# EAGLE design DCDeluxe (EAGLE 6.5.0)

## Sheet 1 of 3
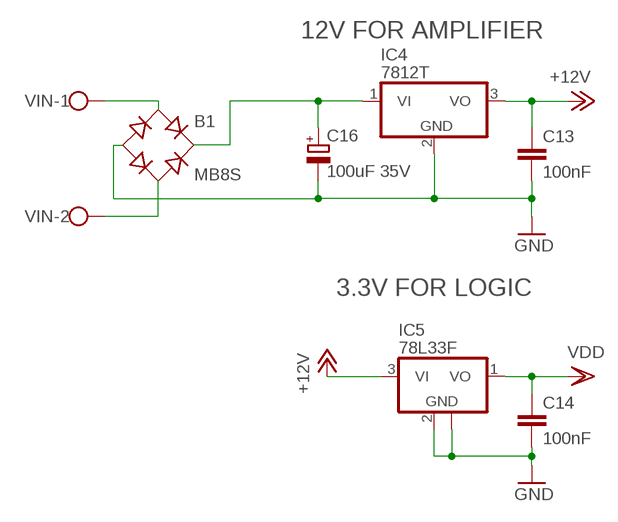
[diagram p0: schematic, sheet 1]

### Parts
B1  MB8S  [SOIC-4]
C13  100nF  C-EUC0603  [C0603]
C14  100nF  C-EUC0603  [C0603]
C16  100uF 35V  CPOL-EU153CLV-0807  [153CLV-0807]
IC4  7812T  [TO220H]
IC5  78L33F  78L05F  [SOT89]
VIN  W237-102  [W237-102]

### Nets
+12V [analog_pwr]: C13.1 IC4.3(VO) IC5.3(VI) ; also sheet 2,3
GND [analog_pwr]: B1.- C13.2 C14.2 C16.- IC4.2(GND) IC5.2(GND) IC5.2@1(GND) ; also sheet 2,3
VDD: C14.1 IC5.1(VO) ; also sheet 2
VIN1 [system_pwr]: B1.~1(AC1) VIN.1 ; also sheet 2
VIN2: B1.~2(AC2) VIN.2 ; also sheet 2
VIN+: B1.+ C16.+ IC4.1(VI)

### Notes on the sheet
- 12V FOR AMPLIFIER
- 3.3V FOR LOGIC

## Sheet 2 of 3: Logic
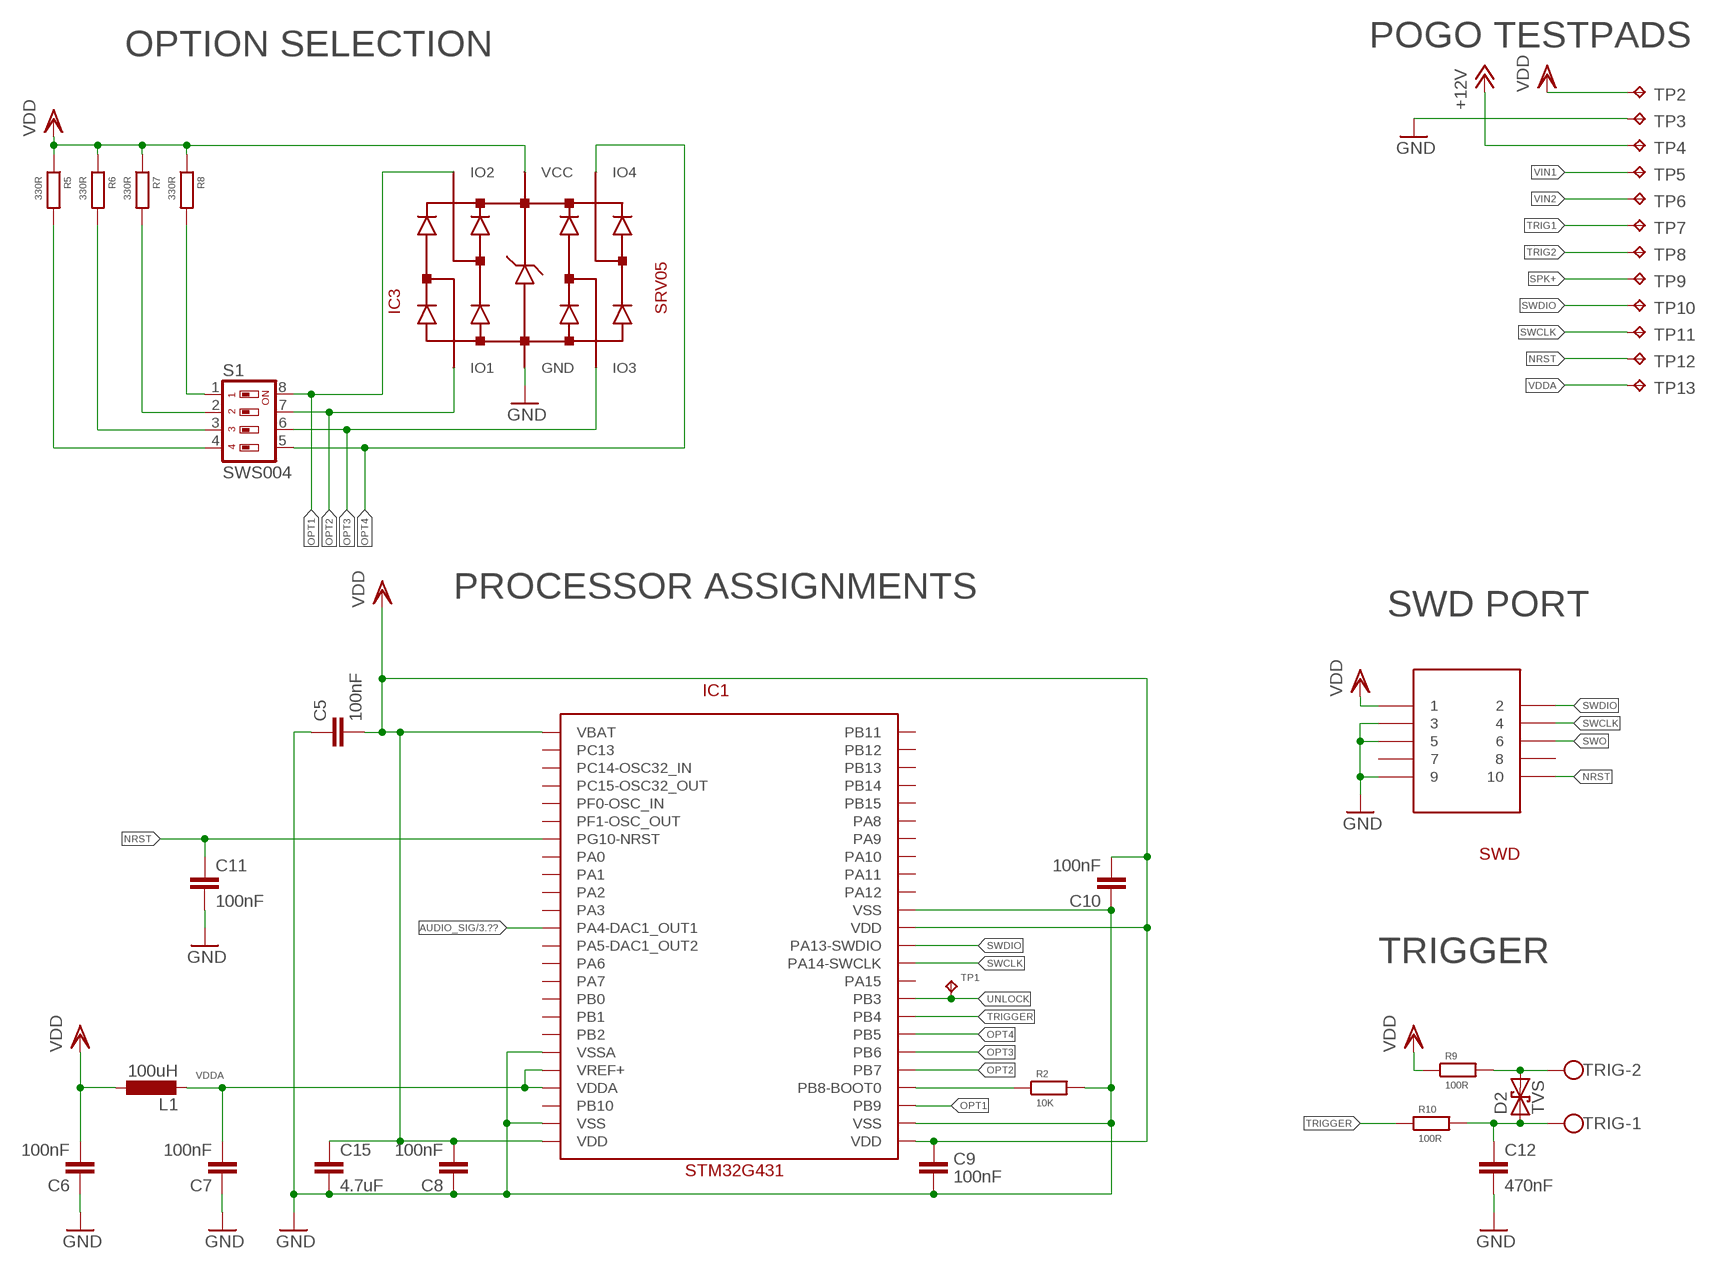
[diagram p1: schematic, sheet 2]

### Parts
C5  100nF  C-EUC0603  [C0603]
C6  100nF  C-EUC0603  [C0603]
C7  100nF  C-EUC0603  [C0603]
C8  100nF  C-EUC0603  [C0603]
C9  100nF  C-EUC0603  [C0603]
C10  100nF  C-EUC0603  [C0603]
C11  100nF  C-EUC0603  [C0603]
C12  470nF  C-EUC0603  [C0603]
C15  4.7uF  C-EUC0603  [C0603]
D2  TVS  [SMA-DIODE]
IC1  STM32G431  STM32G431-C8T6  [TQFP48]
IC3  SRV05  SRV05-TSOP6  [TSOP-6]
L1  100uH  L-EUL3225M  [L3225M]
R2  10K  R-EU_R0603  [R0603]
R5  330R  R-EU_R0603  [R0603]
R6  330R  R-EU_R0603  [R0603]
R7  330R  R-EU_R0603  [R0603]
R8  330R  R-EU_R0603  [R0603]
R9  100R  R-EU_R0603  [R0603]
R10  100R  R-EU_R0603  [R0603]
S1  SWS004  [SMS-004]
SWD  FTSH-105-01  [FTSH-105-01-XXX-DV-K]
TP1  TPTP12R  [TP12R]
TP2  TPTP20R  [TP20R]
TP3  TPTP20R  [TP20R]
TP4  TPTP20R  [TP20R]
TP5  TPTP20R  [TP20R]
TP6  TPTP20R  [TP20R]
TP7  TPTP20R  [TP20R]
TP8  TPTP20R  [TP20R]
TP9  TPTP20R  [TP20R]
TP10  TPTP20R  [TP20R]
TP11  TPTP20R  [TP20R]
TP12  TPTP20R  [TP20R]
TP13  TPTP20R  [TP20R]
TRIG  W237-102  [W237-102]

### Nets
+12V [analog_pwr]: TP4.TP ; also sheet 1,3
AUDIO_SIG [analog_sig]: IC1.PA4-DAC1_OUT1 ; also sheet 3
BOOT0: IC1.PB8-BOOT0 R2.1
GND [analog_pwr]: C5.1 C6.1 C7.1 C8.1 C9.1 C10.1 C11.2 C12.2 C15.2 IC1.VSS@23(VSS) IC1.VSS@35(VSS) IC1.VSS@47(VSS) IC1.VSSA IC3.GND R2.2 SWD.3 SWD.5 SWD.9 TP3.TP ; also sheet 1,3
N$9: R8.2 S1.1
N$10: R7.2 S1.2
N$11: R6.2 S1.3
N$12: R5.2 S1.4
NRST: C11.1 IC1.PG10-NRST SWD.10 TP12.TP
OPT1: IC1.PB9 IC3.IO2 S1.8
OPT2: IC1.PB7 IC3.IO1 S1.7
OPT3: IC1.PB6 IC3.IO3 S1.6
OPT4: IC1.PB5 IC3.IO4 S1.5
SPK+ [analog_pwr]: TP9.TP ; also sheet 3
SWCLK: IC1.PA14-SWCLK SWD.4 TP11.TP
SWDIO: IC1.PA13-SWDIO SWD.2 TP10.TP
SWO: SWD.6
TRIG1: C12.1 D2.A R10.2 TP7.TP TRIG.1
TRIG2: D2.C R9.2 TP8.TP TRIG.2
TRIGGER: IC1.PB4 R10.1
UNLOCK: IC1.PB3 TP1.TP
VDD: C5.2 C6.2 C8.2 C9.2 C10.2 C15.1 IC1.VBAT IC1.VDD@24(VDD) IC1.VDD@36(VDD) IC1.VDD@48(VDD) IC3.VCC L1.1 R5.1 R6.1 R7.1 R8.1 R9.1 SWD.1 TP2.TP ; also sheet 1
VDDA: C7.2 IC1.VDDA IC1.VREF+ L1.2 TP13.TP
VIN1 [system_pwr]: TP5.TP ; also sheet 1
VIN2: TP6.TP ; also sheet 1
Unconnected: IC1.PA0 IC1.PA1 IC1.PA2 IC1.PA3 IC1.PA5-DAC1_OUT2 IC1.PA6 IC1.PA7 IC1.PA8 IC1.PA9 IC1.PA10 IC1.PA11 IC1.PA12 IC1.PA15 IC1.PB0 IC1.PB1 IC1.PB2 IC1.PB10 IC1.PB11 IC1.PB12 IC1.PB13 IC1.PB14 IC1.PB15 IC1.PC13 IC1.PC14-OSC32_IN IC1.PC15-OSC32_OUT IC1.PF0-OSC_IN IC1.PF1-OSC_OUT SWD.7 SWD.8

### Notes on the sheet
- OPTION SELECTION | POGO TESTPADS
- PROCESSOR ASSIGNMENTS
- SWD PORT
- TRIGGER

## Sheet 3 of 3: Analog
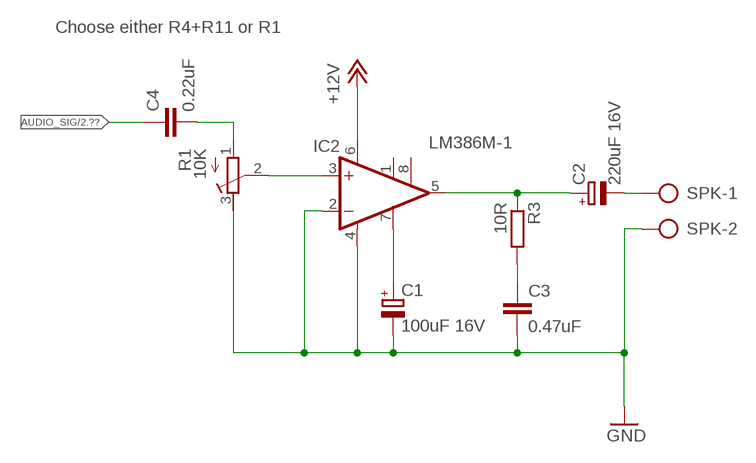
[diagram p2: schematic, sheet 3]

### Parts
C1  100uF 16V  CPOL-EU153CLV-0605  [153CLV-0605]
C2  220uF 16V  CPOL-EU153CLV-0605  [153CLV-0605]
C3  0.47uF  C-EUC0603  [C0603]
C4  0.22uF  C-EUC0603  [C0603]
IC2  LM386M-1  [SO08]
R1  10K  R-TRIMM3339P  [RTRIM3339P]
R3  10R  R-EU_R0805  [R0805]
SPK  W237-102  [W237-102]

### Nets
+12V [analog_pwr]: IC2.6(VS) ; also sheet 1,2
AUDIO_SIG [analog_sig]: C4.1 ; also sheet 2
GND [analog_pwr]: C1.- C3.2 IC2.2(-IN) IC2.4(GND) R1.3(A) SPK.2 ; also sheet 1,2
N$1: IC2.3(+IN) R1.2(S)
N$2 [analog_pwr]: C2.+ IC2.5(OUT) R3.1
N$3 [analog_pwr]: C3.1 R3.2
N$4 [analog_sig]: C4.2 R1.1(E)
N$6 [analog_pwr]: C1.+ IC2.7(BYPASS)
SPK+ [analog_pwr]: C2.- SPK.1 ; also sheet 2
Unconnected: IC2.1(GAIN) IC2.8(GAIN)

### Notes on the sheet
- Choose either R4+R11 or R1

## Library data of the parts
B1 = rectifier:MB*S: Bridge Rectifier Source: http://www.fairchildsemi.com/ds/MB/MB6S.pdf
C1 C2 C16 = rcl:CPOL-EU: POLARIZED CAPACITOR, European symbol
C3-C15 = rcl:C-EU: CAPACITOR, European symbol
D2 = SparkFun-DiscreteSemi:TVS: Transient voltage suppressor- prevents ESD on inputs. Ignore package description- MBRA140 is NOT this type of part!!!
IC1 = STM32G431:STM32G431-C8T6: STM32G431C8T6 64K of FLASH, 32K or RAM, 170MHz Cortex M4 with single precision floating point unit. Also, Two DACs.
IC2 = linear:LM386?-*: Low Voltage Audio Power Amplifier Source: http://cache.national.com/ds/LM/LM386.pdf
IC3 = TVS_DIODES:SRV05-TSOP6
IC4 = linear:78*: Positive VOLTAGE REGULATOR Source: http://cache.national.com/ds/LM/LM78L05.pdf http://www.fairchildsemi.com/ds/LM/LM7805.pdf
IC5 = linear:78L*: POSITOIV-VOLTAGE REGULATORS Output up to 100 mA Source: http://focus.ti.com/lit/ds/symlink/ua78l05.pdf
L1 = rcl:L-EU: INDUCTOR, European symbol
R1 = rcl:R-TRIMM: Trimm resistor
R2 R3 R5-R10 = rcl:R-EU_: RESISTOR, European symbol
S1 = smd-special:SWS004: SMD Dip Switch 4 pol.
SPK TRIG VIN = con-wago-500:W237-102: WAGO SCREW CLAMP; MPN: 237-102; OC_FARNELL: unknown; OC_NEWARK: 70K9898
SWD = Con-Samtech (Duncs):FTSH-105-01
TP1-TP13 = testpad:TP: Test pad

## Net classes
0 sgnal: width 0.152 mm, clearance 0.305 mm
1 analog_pwr: width 0.61 mm, clearance 0.406 mm
2 analog_sig: width 0.152 mm, clearance 0.457 mm
3 system_pwr: width 0.889 mm, clearance 0.457 mm

## Board
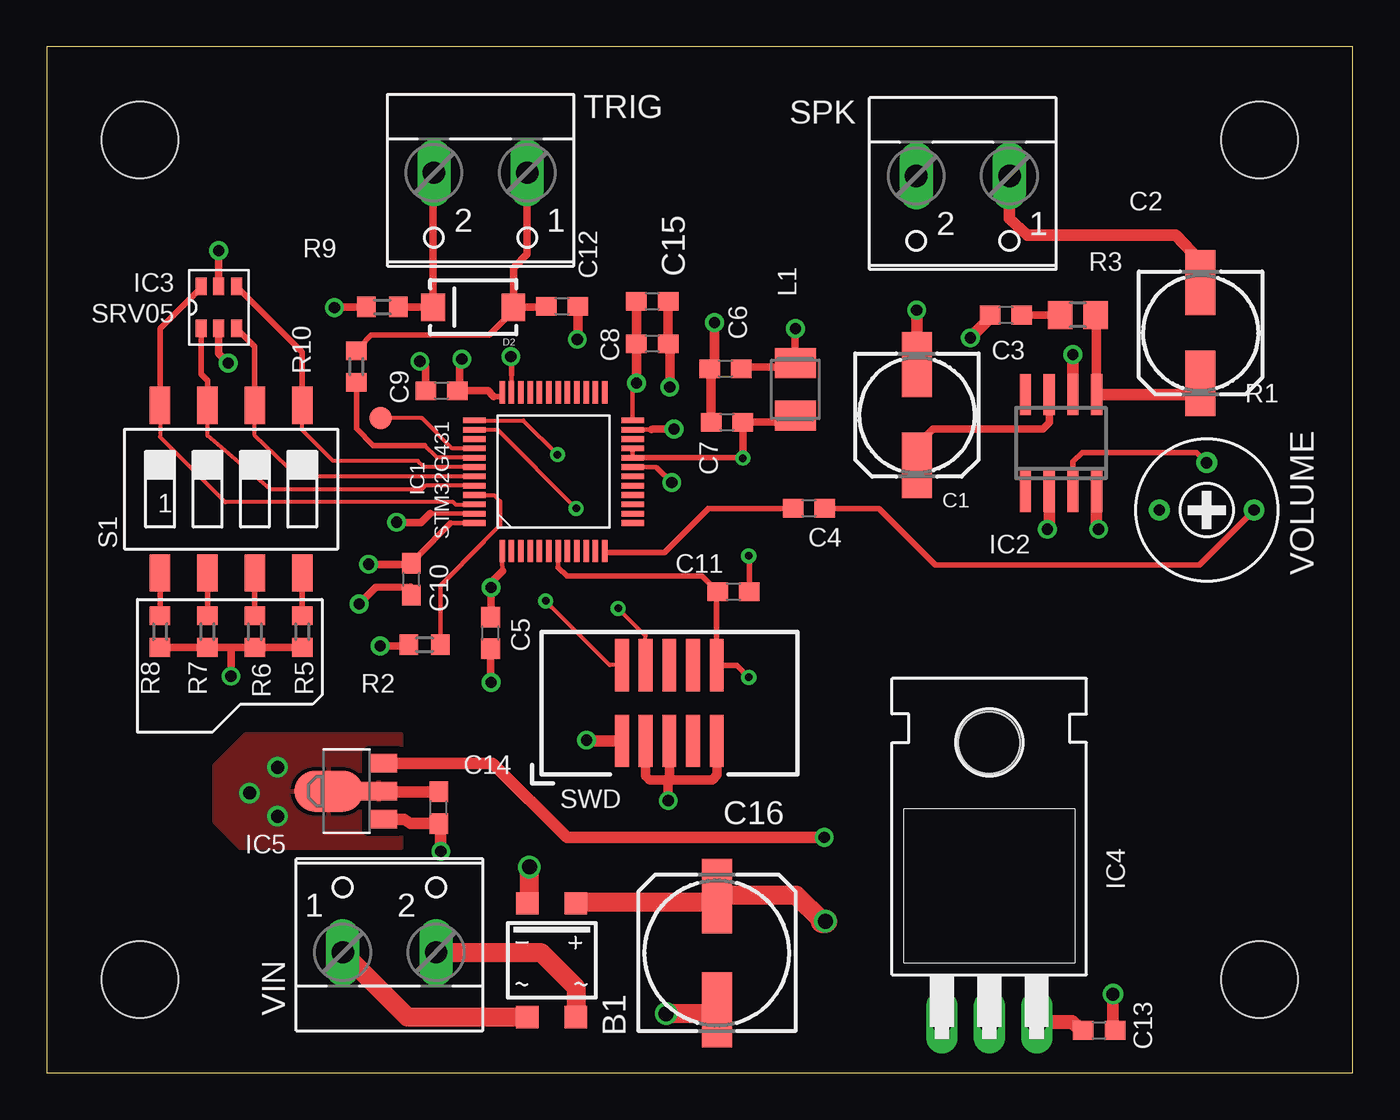
[diagram p3: board, top side]
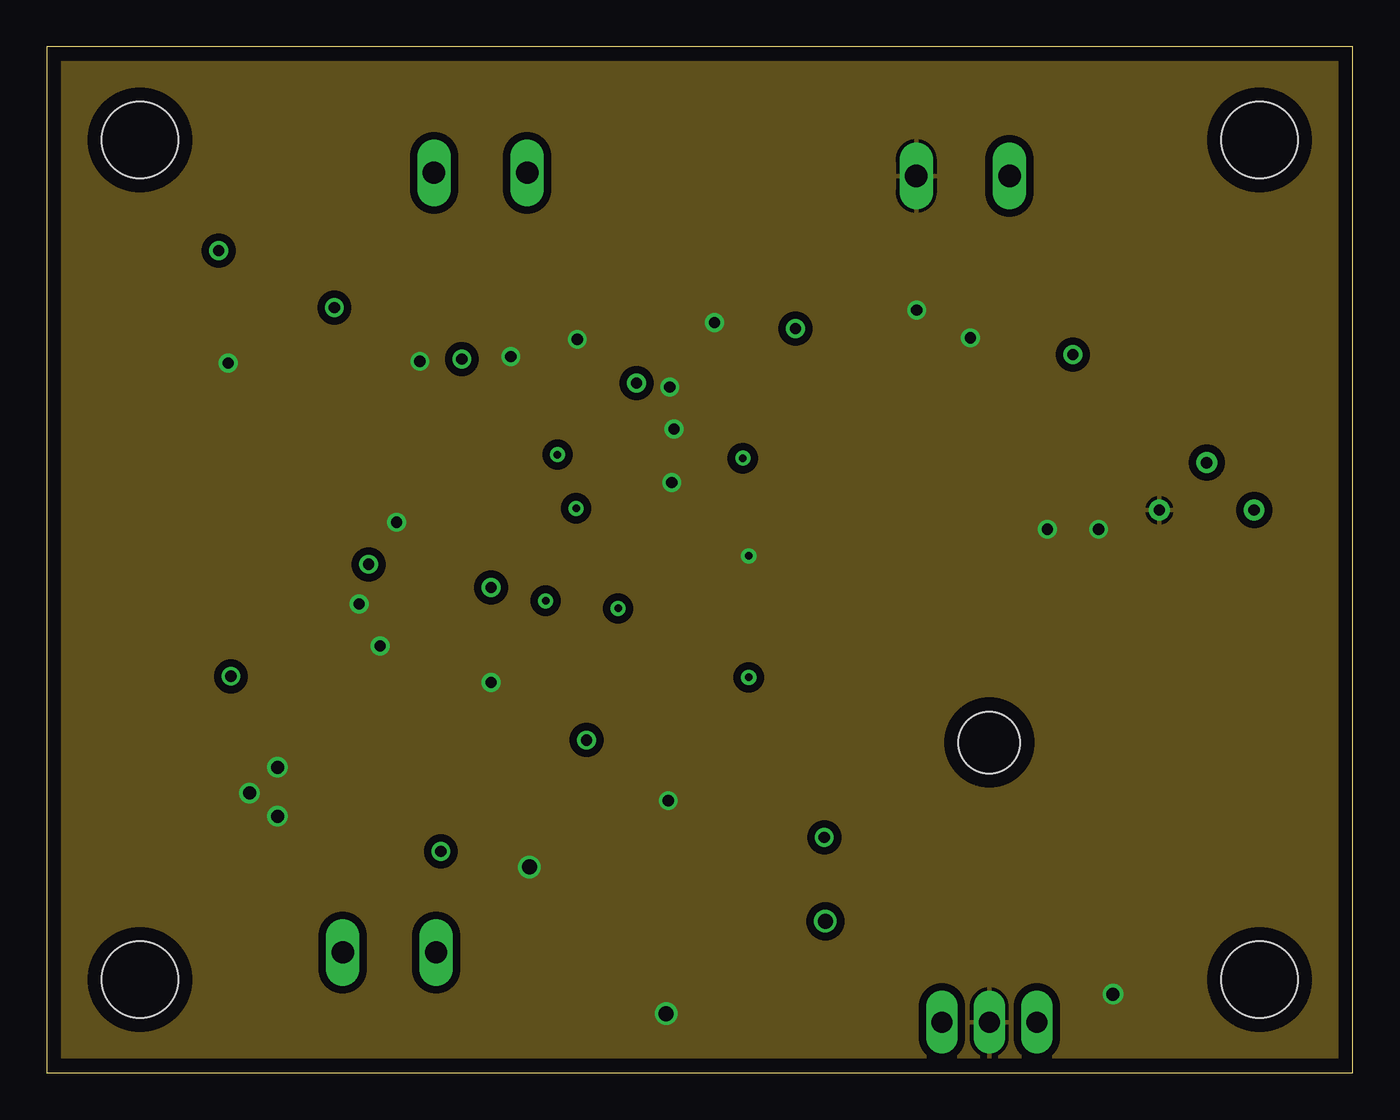
[diagram p4: board, inner layer Route2]
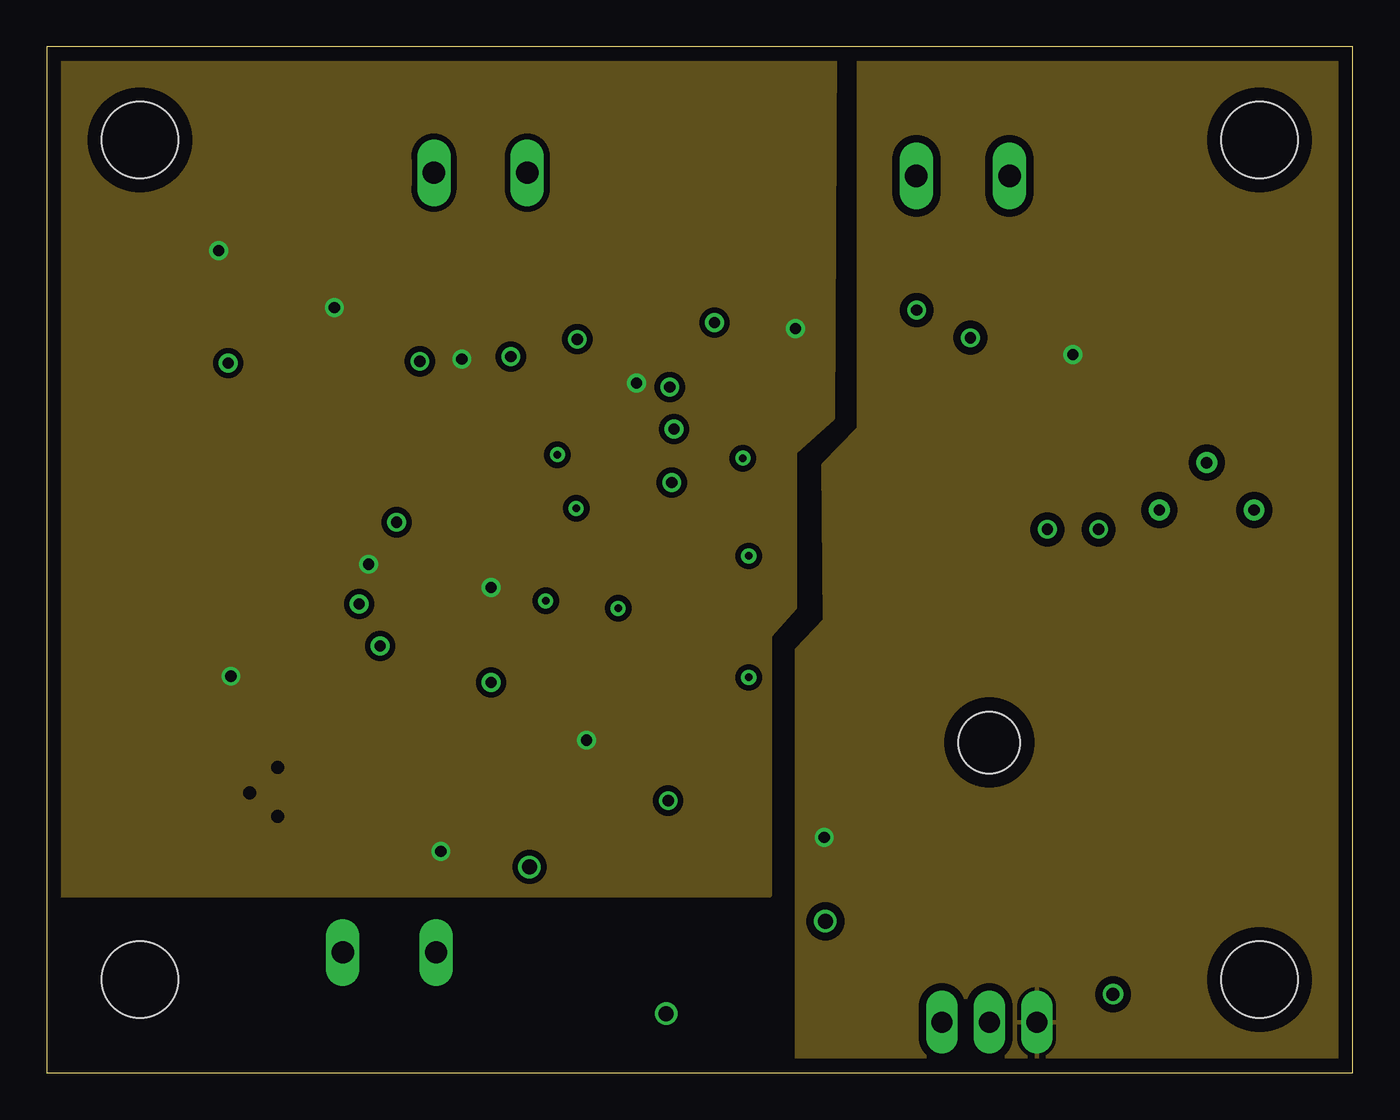
[diagram p5: board, inner layer Route15]
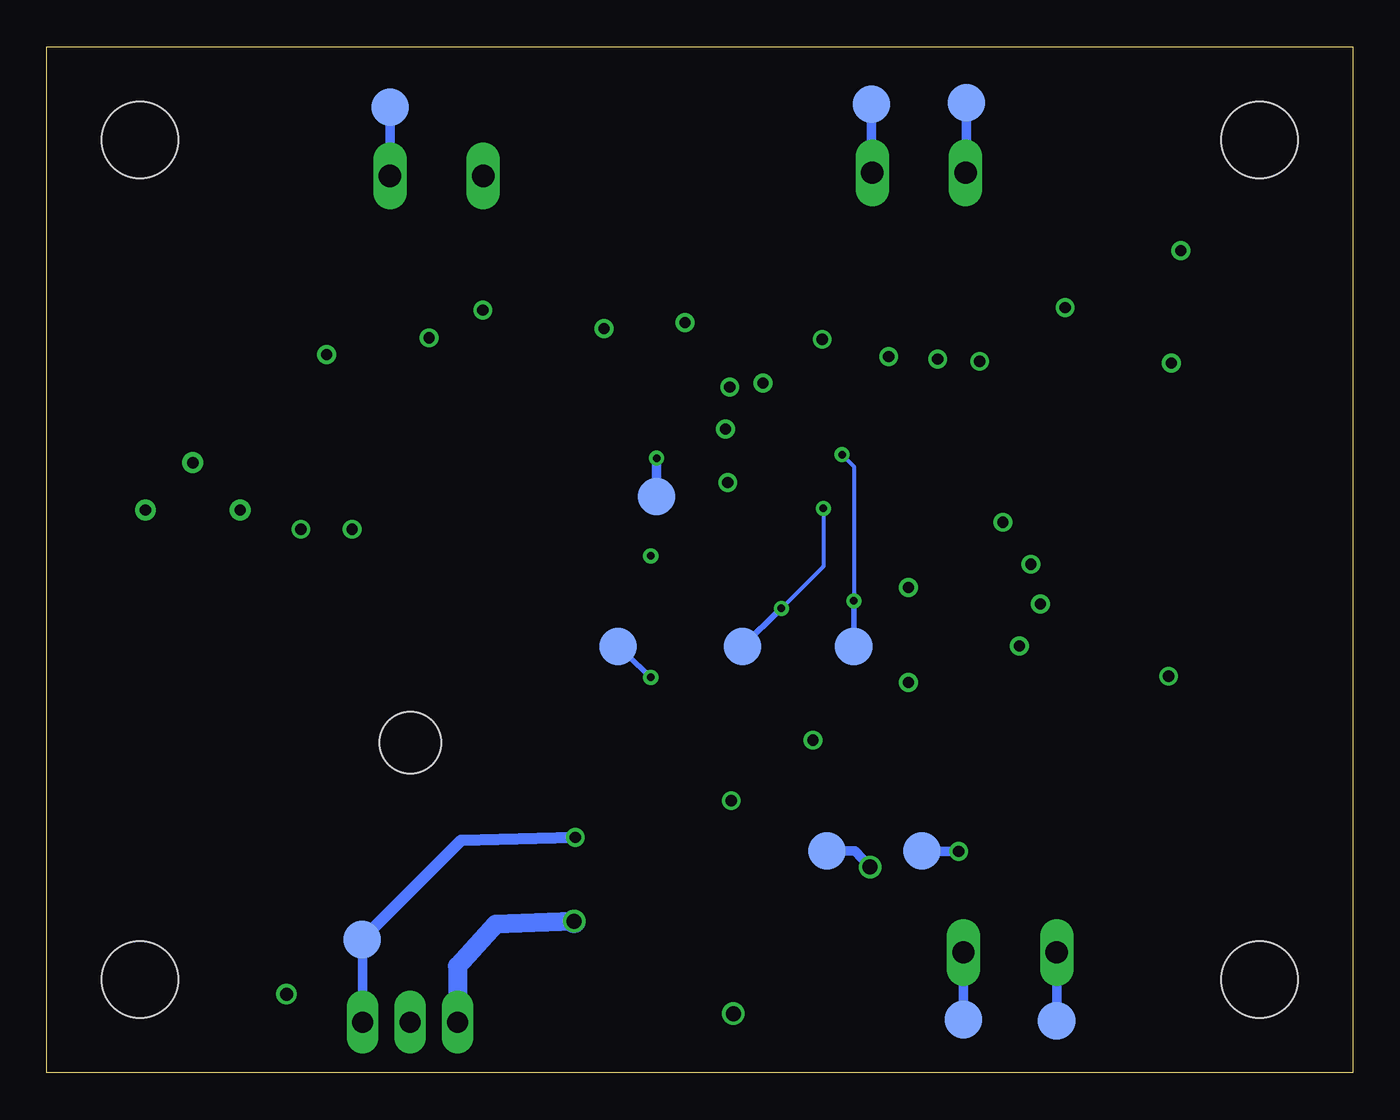
[diagram p6: board, bottom side, seen from below]

Size 70 x 55 mm. Coordinates in mm from the lower left corner, seen from the top.
Outline: 0,0 70,0 70,55 0,55 0,0
Copper layers ((1+2)*(15+16)): Top 0.035mm / dielectric 0.78mm / Route2 0.035mm / dielectric 0.1mm / Route15 0.035mm / dielectric 0.78mm / Bottom 0.035mm
Design rules "default *": minimum track width 6mil, minimum drill 0.3mm, track to track 3mil, track to pad 3mil, pad to pad 3mil, via to via 3mil, smd to smd 3mil, copper to edge 30mil, drill to drill 8mil, minimum pad ring 10mil, minimum via ring 8mil, stop-mask expansion 4mil, vias tented up to drill 0mil, thermal gap 8mil
Holes 4.1 mm at 5,5 65,5 65,50 5,50

### Footprints (pad centres in the part's own frame; a part is rotated, then mirrored left to right if it is on the bottom)
SOIC-4 = smd 1.2 x 1.2: + 1.3,3.05; - -1.3,3.05; ~1 -1.3,-3.05; ~2 1.3,-3.05
153CLV-0605 = smd 3.5 x 1.6: + 2.7,0; - -2.7,0
C0603 = smd 1.1 x 1: 1 -0.85,0; 2 0.85,0
153CLV-0807 = smd 4 x 1.6: + 3.05,0; - -3.05,0
SMA-DIODE = smd 1.27 x 1.47: A -2.15,0; C 2.15,0
TQFP48 = smd 1.2 x 0.3: PA0 -4.25,-0.75; PA1 -4.25,-1.25; PA2 -4.25,-1.75; PA3 -4.25,-2.25; PA4-DAC1_OUT1 -4.25,-2.75; PA8 4.25,-0.25; PA9 4.25,0.25; PA10 4.25,0.75; PA11 4.25,1.25; PA12 4.25,1.75; PB11 4.25,-2.75; PB12 4.25,-2.25; PB13 4.25,-1.75; PB14 4.25,-1.25; PB15 4.25,-0.75; PC13 -4.25,2.25; PC14-OSC32_IN -4.25,1.75; PC15-OSC32_OUT -4.25,1.25; PF0-OSC_IN -4.25,0.75; PF1-OSC_OUT -4.25,0.25; PG10-NRST -4.25,-0.25; VBAT -4.25,2.75; VDD@36 4.25,2.75; VSS@35 4.25,2.25 | smd 0.3 x 1.2: PA5-DAC1_OUT2 -2.75,-4.25; PA6 -2.25,-4.25; PA7 -1.75,-4.25; PA13-SWDIO 2.75,4.25; PA14-SWCLK 2.25,4.25; PA15 1.75,4.25; PB0 -1.25,-4.25; PB1 -0.75,-4.25; PB2 -0.25,-4.25; PB3 1.25,4.25; PB4 0.75,4.25; PB5 0.25,4.25; PB6 -0.25,4.25; PB7 -0.75,4.25; PB8-BOOT0 -1.25,4.25; PB9 -1.75,4.25; PB10 1.75,-4.25; VDD@24 2.75,-4.25; VDD@48 -2.75,4.25; VDDA 1.25,-4.25; VREF+ 0.75,-4.25; VSS@23 2.25,-4.25; VSS@47 -2.25,4.25; VSSA 0.25,-4.25
SO08 = smd 0.6 x 2.2: 1 -1.905,-2.6; 2 -0.635,-2.6; 3 0.635,-2.6; 4 1.905,-2.6; 5 1.905,2.6; 6 0.635,2.6; 7 -0.635,2.6; 8 -1.905,2.6
TSOP-6 = smd 0.95 x 0.6: GND -1.125,0; IO1 -1.125,0.95; IO2 1.125,0.95; IO3 -1.125,-0.95; IO4 1.125,-0.95; VCC 1.125,0
TO220H = drill 1.118 long: 1 -2.54,-10.16; 2 0,-10.16; 3 2.54,-10.16 | hole 3.302: 0,4.826
SOT89 = smd 1 x 1.5: 1 -1.499,-1.981; 3 1.499,-1.981 | smd 1 x 2: 2 0,-1.727 | smd 2.2 x 3.7: 2@1 0,0.94
L3225M = smd 1.6 x 2.2: 1 -1.4,0; 2 1.4,0
RTRIM3339P = drill 0.61: 1 -2.54,0; 2 0,-2.54; 3 2.54,0
R0603 = smd 1 x 1.1: 1 -0.85,0; 2 0.85,0
R0805 = smd 1.3 x 1.5: 1 -0.95,0; 2 0.95,0
SMS-004 = smd 1.092 x 2.007: 1 -3.81,-4.496; 2 -1.27,-4.496; 3 1.27,-4.496; 4 3.81,-4.496; 5 3.81,4.496; 6 1.27,4.496; 7 -1.27,4.496; 8 -3.81,4.496
W237-102 = drill 1.194 long: 1 -2.5,-1.27; 2 2.5,-1.27
FTSH-105-01-XXX-DV-K = smd 0.737 x 2.794: 1 -2.54,-2.032; 2 -2.54,2.032; 3 -1.27,-2.032; 4 -1.27,2.032; 5 0,-2.032; 6 0,2.032; 7 1.27,-2.032; 8 1.27,2.032; 9 2.54,-2.032; 10 2.54,2.032
TP12R = smd 1.2 x 1.2: TP 0,0
TP20R = smd 2 x 2: TP 0,0

### Placement (x,y rotation side)
B1  27.07,6.03 0 top
C1  46.63,35.26 270 top
C2  61.83,39.65 270 top
C3  51.41,40.62 180 top
C4  40.86,30.27 0 top
C5  23.79,23.58 90 top
C6  36.38,37.74 0 top
C7  36.47,34.87 0 top
C8  32.46,39.08 180 top
C9  21.17,36.56 0 top
C10  19.55,26.46 90 top
C11  36.81,25.78 0 top
C12  27.62,41.09 0 top
C13  56.4,2.28 0 top
C14  21.01,14.21 90 top
C15  32.46,41.35 0 top
C16  35.92,6.43 90 top
D2  22.86,41.04 180 top
IC1  27.16,32.22 90 top
IC2  54.36,33.76 0 top
IC3  9.22,41.02 90 top
IC4  50.52,12.88 0 top
IC5  16.05,15.1 90 top
L1  40.12,36.63 270 top
R1  62.17,30.16 180 top
R2  20.25,22.95 180 top
R3  55.26,40.62 180 top
R5  13.7,23.65 90 top
R6  11.16,23.65 90 top
R7  8.62,23.65 90 top
R8  6.08,23.65 90 top
R9  17.99,41.04 0 top
R10  16.6,37.85 90 top
S1  9.89,31.29 0 top
SPK  49.1,46.8 180 top
SWD  33.37,19.82 0 top
TP1  17.89,35.09 0 top
TP2  23.1,11.91 0 bottom
TP3  28.18,11.91 0 bottom
TP4  53.1,7.14 0 bottom
TP5  15.88,2.78 0 bottom
TP6  20.88,2.86 0 bottom
TP7  25.8,51.91 0 bottom
TP8  20.72,51.99 0 bottom
TP9  51.59,51.75 0 bottom
TP10  26.75,22.86 0 bottom
TP11  32.7,22.86 0 bottom
TP12  39.37,22.86 0 bottom
TP13  37.31,30.88 0 bottom
TRIG  23.25,46.97 180 top
VIN  18.37,7.72 0 top

### Tracks (layer width: path | path; a pad name or v marks a point on that pad's centre or on a via)
+12V  (via drill 0.6, 0.6 pad 0.35)
  Top 0.406: IC2.6
  Top 0.61: IC5.3 23.91,16.59 27.88,12.62 v41.67,12.62 | C13.1 55.51,2.24 | IC2.6 v55,38.49
  Top 0.762: 55.51,2.24 54.96,2.72 IC4.3
  Bottom 0.508: 53.1,2.76 IC4.3 53.06,7.1 TP4.TP
  Bottom 0.61: v41.67,12.62 47.78,12.46 TP4.TP
  pour Route15: 70.25,0 70.25,55 43.51,55 43.51,34.53 41.6,32.58 41.68,24.26 40.17,22.66 40.17,0
AUDIO_SIG
  Top 0.305: IC1.PA4-DAC1_OUT1 30,27.88 33.1,27.88 35.47,30.26 | 40.24,30.26 35.47,30.26 | 35.47,30.26 35.43,30.26
  Top 0.406: 40.24,30.26 C4.1
BOOT0
  Top 0.203: IC1.PB8-BOOT0 23.96,30.97 24.3,30.63 24.3,29.36 23.42,28.48 23.42,28.45
  Top 0.254: 23.42,28.45 21.1,26.13 R2.1
GND  (via drill 0.4, 0.6, 0.6 pad 0.35, 0.7 layers 1-2, 0.7 pad 0.35, 0.8)
  Top 0.254: IC1.VSSA 32.66,32.47 32.72,32.41 | IC1.VSS@35 24.91,37.42 | IC1.VSS@47 20.54,29.97 | IC1.VSS@23 32.41,34.47
  Top 0.305: 9.71,38.17 v9.72,38.04 | 19.34,23.01 R2.2 | 19.5,26.03 C10.1 | 32.72,32.41 v33.5,31.63 | 24.91,37.42 24.91,38.04 v24.88,38.38 | C11.2 37.66,27.42 v37.62,27.7
  Top 0.406: v16.75,25.13 17.62,26.01 19.5,26.03 | 33.31,15.71 33.43,15.71 33.37,15.9 | 35.93,17.76 SWD.9 | C7.1 35.62,34.88 | 28.53,41.14 C12.2 28.52,41.14 | v23.82,20.93 23.79,21.1 C5.1 | 19.34,23.01 19.22,22.88 v17.88,22.88 | IC3.GND 9.22,38.54 v9.72,38.04 | 32.41,34.47 32.5,34.51 v33.62,34.51 | 20.54,29.97 20.07,29.51 v18.75,29.51 | C9.1 20.32,37.81 v20,38.13
  Top 0.508: SWD.3 32.1,15.92 32.31,15.71 33.31,15.71 v33.31,14.59 | 33.43,15.71 35.68,15.71 35.93,15.96 35.93,17.76 | SWD.5 33.37,15.9 | 50.59,40.51 C3.2 | v33.4,36.75 33.4,38.99 arc90 C8.1 C15.2 | C7.1 35.62,37.65 arc90 C6.1 arc-90 35.62,37.64 35.78,37.8 v35.78,40.2 | v28.44,39.32 28.47,39.35 C12.2
  Top 0.61: v53.62,29.13 53.73,29.16 IC2.2 | v56.38,29.13 56.27,29.27 IC2.4 | C1.- 46.62,39.34 v46.62,40.88 | IC5.2@1 IC5.2 18.07,15.06 C14.2 | C13.2 57.05,2.16 57.15,2.38 v57.15,4.22 | v49.51,39.4 50.59,40.51
  Top 1.016: 35.88,3.17 v33.2,3.17 | B1.- 25.88,9.29 v25.88,11.03
  Top 1.27: C16.- 35.88,3.17
  Bottom 0.508: TP3.TP 26.67,11.91 v25.88,11.03
  other vias: 12.38,16.38 10.88,15 12.38,13.75
  pour Route2: 0,55 70,55 70,0 0,0
  pour Top: 19,18.14 10.67,18.14 9,16.46 9,13.44 10.38,12.07 19,12.07
N$1
  Top 0.305: IC2.3 54.99,32.75 55.5,33.26 61.61,33.26 R1.2
N$2
  Top 0.406: 56.25,40.43 R3.1 | IC2.5
  Top 0.508: 61.65,36.36 C2.+ | IC2.5 56.27,40.33 R3.1
  Top 0.61: IC2.5 61.65,36.36
N$3
  Top 0.406: C3.1 54.27,40.6 R3.2
N$4
  Top 0.305: 41.97,30.24 44.61,30.24 47.62,27.23 61.77,27.23 R1.1
  Top 0.406: 41.97,30.24 C4.2
N$6
  Top 0.406: IC2.7 53.73,34.86 53.38,34.51 47.5,34.51 46.62,33.63 C1.+
N$9
  Top 0.305: S1.1 R8.2
N$10
  Top 0.305: S1.2 R7.2
N$11
  Top 0.305: S1.3 R6.2
N$12
  Top 0.305: S1.4 R5.2
NRST  (via drill 0.4)
  Top 0.254: IC1.PG10-NRST 27.41,27.1
  Top 0.305: 27.41,27.1 27.88,26.63 35.11,26.63 C11.1 35.91,25.73 SWD.10 35.97,21.83 36.99,21.83 v37.62,21.19
  Top 0.406: 35.91,25.78 C11.1 | SWD.10 35.88,21.85
  Bottom 0.305: TP12.TP v37.62,21.19
OPT1
  Top 0.203: S1.8 6.08,34.08 9.57,30.59 21.79,30.59 21.91,30.47 IC1.PB9
  Top 0.305: IC3.IO2 8.28,42.09 6.08,39.9 S1.8
OPT2
  Top 0.203: IC1.PB7 20.3,31.47 20.1,31.27 12,31.27 8.62,34.14 S1.7
  Top 0.305: IC3.IO1 8.28,37.45 8.62,37.1 S1.7
OPT3
  Top 0.203: S1.6 11.16,34.14 13.46,31.97 IC1.PB6
  Top 0.305: IC3.IO3 11.16,38.91 S1.6
OPT4
  Top 0.203: IC1.PB5 20.22,32.47 19.89,32.8 15.37,32.8 13.7,34.46 S1.5
  Top 0.305: S1.5 13.7,38.62 IC3.IO4
SPK+
  Top 0.508: 61.82,43.51 61.82,42.27 C2.-
  Top 0.61: SPK.1 51.6,45.78 52.56,44.9 60.5,44.9 61.82,43.51
  Bottom 0.508: TP9.TP SPK.1
SWCLK  (via drill 0.4 pad 0.35)
  Top 0.203: IC1.PA14-SWCLK 24.16,34.47 v28.38,30.26 | SWD.4 32.1,23.42 v30.62,24.89
  Bottom 0.203: v28.38,30.26 28.38,27.14 v30.62,24.89
  Bottom 0.305: TP11.TP 30.64,24.88 arc90 v30.62,24.89
SWDIO  (via drill 0.4 pad 0.35)
  Top 0.203: IC1.PA13-SWDIO 25.54,34.97 v27.38,33.13 | SWD.2 30.17,21.85 27.06,24.96 v26.74,25.3
  Bottom 0.203: v27.38,33.13 26.75,32.51 v26.75,25.29 v26.74,25.3
  Bottom 0.305: TP10.TP v26.75,25.29 arc90 v26.74,25.3
TRIG1
  Top 0.305: C12.1 27.07,41.14 | R10.2 16.82,38.95 17.39,39.55 23.72,39.55 25.01,40.84 D2.A
  Top 0.406: 26.84,41.1 C12.1 26.72,41.04 D2.A 25.01,43.14 25.75,43.89 TRIG.1 | 27.07,41.14 26.84,40.98
  Bottom 0.508: TP7.TP 25.8,48.28 TRIG.1
TRIG2
  Top 0.406: 18.86,41.06 R9.2 D2.C 20.71,48.08 20.82,48.18 TRIG.2
  Bottom 0.508: TP8.TP 20.72,48.28 TRIG.2
TRIGGER
  Top 0.203: IC1.PB4 20.92,32.97 20.26,33.63
  Top 0.305: 20.26,33.63 17.5,33.63 16.6,34.53 R10.1
UNLOCK
  Top 0.203: IC1.PB3 21.74,33.47 20.12,35.09 TP1.TP
VDD  (via drill 0.6, 0.6 pad 0.35)
  Top 0.203: 24.37,36.26 24.41,36.29 IC1.VDD@36
  Top 0.254: IC1.VBAT 24.41,27.43 24.43,26.9 | 21.66,29.47 IC1.VDD@48 | IC1.VDD@24 31.41,36.77
  Top 0.305: C10.2 19.38,27.26 | 21.66,29.47 19.87,27.68 | 24.37,36.26 23.95,36.26 | 31.41,36.77 arc-90 v31.61,36.96
  Top 0.406: 30.81,17.76 SWD.1 | R9.1 15.45,41.04 v15.42,41.02 | R8.1 R7.1 9.88,22.8 | 9.88,22.8 R6.1 R5.1 | v9.88,21.26 9.88,22.8 | 19.38,27.26 v17.25,27.26 | 19.87,27.68 C10.2 | IC3.VCC v9.22,44.06 | 23.95,36.26 23.65,36.56 C9.2 22.12,36.79 22.12,38.13 v22.25,38.26 | v40.13,39.88 40.12,39.77 40.12,37.97 40.03,37.95 39.68,37.83 37.4,37.83 C6.2 | C5.2 23.82,24.45 v23.82,26.01 23.82,26.29 24.43,26.9
  Top 0.508: L1.1 40.12,37.97 | v31.61,36.96 C8.2 arc90 C8.2 C15.1
  Top 0.61: IC5.1 19.15,13.6 19.52,13.36 C14.1 21.12,12.88 21.12,11.99 v21.12,11.88 | v28.93,17.84 28.98,17.79 SWD.1
  Bottom 0.508: 21.16,11.91 v21.12,11.88 23.15,11.88 TP2.TP
  pour Route15: 42.25,55 42.12,35.08 40.09,33.25 40.09,24.91 38.75,23.41 38.75,9.5 0.12,9.5 0,55
VDDA  (via drill 0.4)
  Top 0.254: IC1.VREF+ IC1.VDDA
  Top 0.305: IC1.VREF+ 37.28,32.97 arc-90 v37.31,32.94 | C7.2 37.31,34.86
  Top 0.406: 39.3,34.87 C7.2 | 37.31,34.86 v37.31,32.94
  Top 0.508: L1.2 39.66,35.23 39.3,34.87
  Bottom 0.508: TP13.TP v37.31,32.94
VIN1
  Top 1.016: B1.~1 19.34,2.98 VIN.1
  Bottom 0.508: VIN.1 TP5.TP
VIN2
  Top 1.016: VIN.2 26.49,6.46 28.37,4.57 B1.~2
  Bottom 0.508: TP6.TP VIN.2
VIN+  (via drill 0.8 pad 0.35)
  Top 1.016: 41.57,8.12 40.16,9.53 35.96,9.53 | B1.+ 28.45,9.16 35.64,9.16 35.64,9.21 C16.+
  Top 1.27: v41.73,8.12 41.57,8.12 | 35.96,9.53 C16.+
  Bottom 1.016: v41.73,8.12 45.93,7.97 47.98,5.72 IC4.1
  Bottom 1.27: v41.73,8.12

### Text on the board
tNames: VOLUME
tValues: + | -